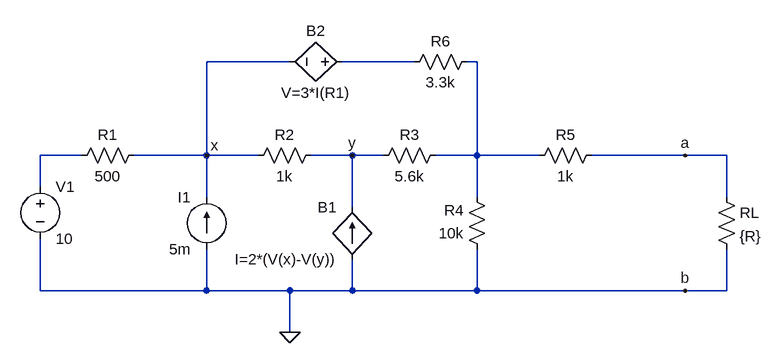
[diagram p0: schematic Circuit_4(1).asc]
Circuit_4(1).asc, the LTspice schematic file:
Version 4
SHEET 1 1304 680
WIRE 400 -32 272 -32
WIRE 592 -32 480 -32
WIRE 688 -32 672 -32
WIRE 80 112 16 112
WIRE 272 112 272 -32
WIRE 272 112 160 112
WIRE 352 112 272 112
WIRE 496 112 432 112
WIRE 544 112 496 112
WIRE 688 112 688 -32
WIRE 688 112 624 112
WIRE 784 112 688 112
WIRE 1008 112 864 112
WIRE 1072 112 1008 112
WIRE 16 160 16 112
WIRE 272 176 272 112
WIRE 688 176 688 112
WIRE 1072 176 1072 112
WIRE 496 192 496 112
WIRE 16 320 16 240
WIRE 272 320 272 256
WIRE 272 320 16 320
WIRE 400 320 272 320
WIRE 496 320 496 272
WIRE 496 320 400 320
WIRE 688 320 688 256
WIRE 688 320 496 320
WIRE 1008 320 688 320
WIRE 1072 320 1072 256
WIRE 1072 320 1008 320
WIRE 400 384 400 320
FLAG 272 112 x
FLAG 496 112 y
FLAG 400 384 0
FLAG 1008 112 a
FLAG 1008 320 b
SYMBOL voltage 16 144 R0
SYMATTR InstName V1
SYMATTR Value 10
SYMBOL res 176 96 R90
WINDOW 0 0 56 VBottom 2
WINDOW 3 32 56 VTop 2
SYMATTR InstName R1
SYMATTR Value 500
SYMBOL res 336 128 R270
WINDOW 0 32 56 VTop 2
WINDOW 3 0 56 VBottom 2
SYMATTR InstName R2
SYMATTR Value 1k
SYMBOL res 640 96 R90
WINDOW 0 0 56 VBottom 2
WINDOW 3 32 56 VTop 2
SYMATTR InstName R3
SYMATTR Value 5.6k
SYMBOL res 704 272 R180
WINDOW 0 36 76 Left 2
WINDOW 3 36 40 Left 2
SYMATTR InstName R4
SYMATTR Value 10k
SYMBOL res 768 128 R270
WINDOW 0 32 56 VTop 2
WINDOW 3 0 56 VBottom 2
SYMATTR InstName R5
SYMATTR Value 1k
SYMBOL res 576 -16 R270
WINDOW 0 32 56 VTop 2
WINDOW 3 0 56 VBottom 2
SYMATTR InstName R6
SYMATTR Value 3.3k
SYMBOL bv 496 -32 R90
WINDOW 0 -32 56 VBottom 2
WINDOW 3 32 56 VTop 2
SYMATTR InstName B2
SYMATTR Value V=3*I(R1)
SYMBOL bi 496 272 R180
WINDOW 0 24 80 Left 2
WINDOW 3 24 0 Left 2
SYMATTR InstName B1
SYMATTR Value I=2*(V(x)-V(y))
SYMBOL current 272 256 R180
WINDOW 0 24 80 Left 2
WINDOW 3 24 0 Left 2
SYMATTR InstName I1
SYMATTR Value 5m
SYMBOL res 1056 160 R0
SYMATTR InstName RL
SYMATTR Value {R}

The netlist it stands for:
* Circuit_4(1).asc
V1 N003 0 10
R1 x N003 500
R2 x y 1k
R3 N002 y 5.6k
R4 0 N002 10k
R5 N002 a 1k
R6 N001 N002 3.3k
B2 N001 x V=3*I(R1)
B1 0 y I=2*(V(x)-V(y))
I1 0 x 5m
RL a 0 {R}
.backanno
.end